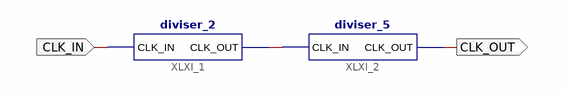
[diagram p0: schematic sheet 1]
// Xilinx ISE schematic diviser_10.sch (spartan6) as structural Verilog: 2 symbols, 2 ports
module diviser_10 (
  input  CLK_IN,
  output CLK_OUT
);

  wire XLXN_1;

  diviser_2 XLXI_1 (.CLK_IN(CLK_IN), .CLK_OUT(XLXN_1));
  diviser_5 XLXI_2 (.CLK_IN(XLXN_1), .CLK_OUT(CLK_OUT));
endmodule
